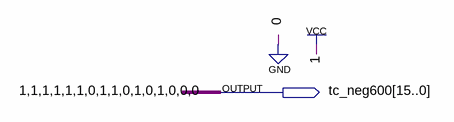
[diagram p0: schematic sheet]
// Quartus schematic tc_neg600.bdf as structural Verilog: 0 symbols, 1 pins
module tc_neg600 (
  output [15:0] tc_neg600
);


  assign tc_neg600 = 16'b1111110110101000;
endmodule
